# EAGLE design board_0.1v (EAGLE 7.7.0)
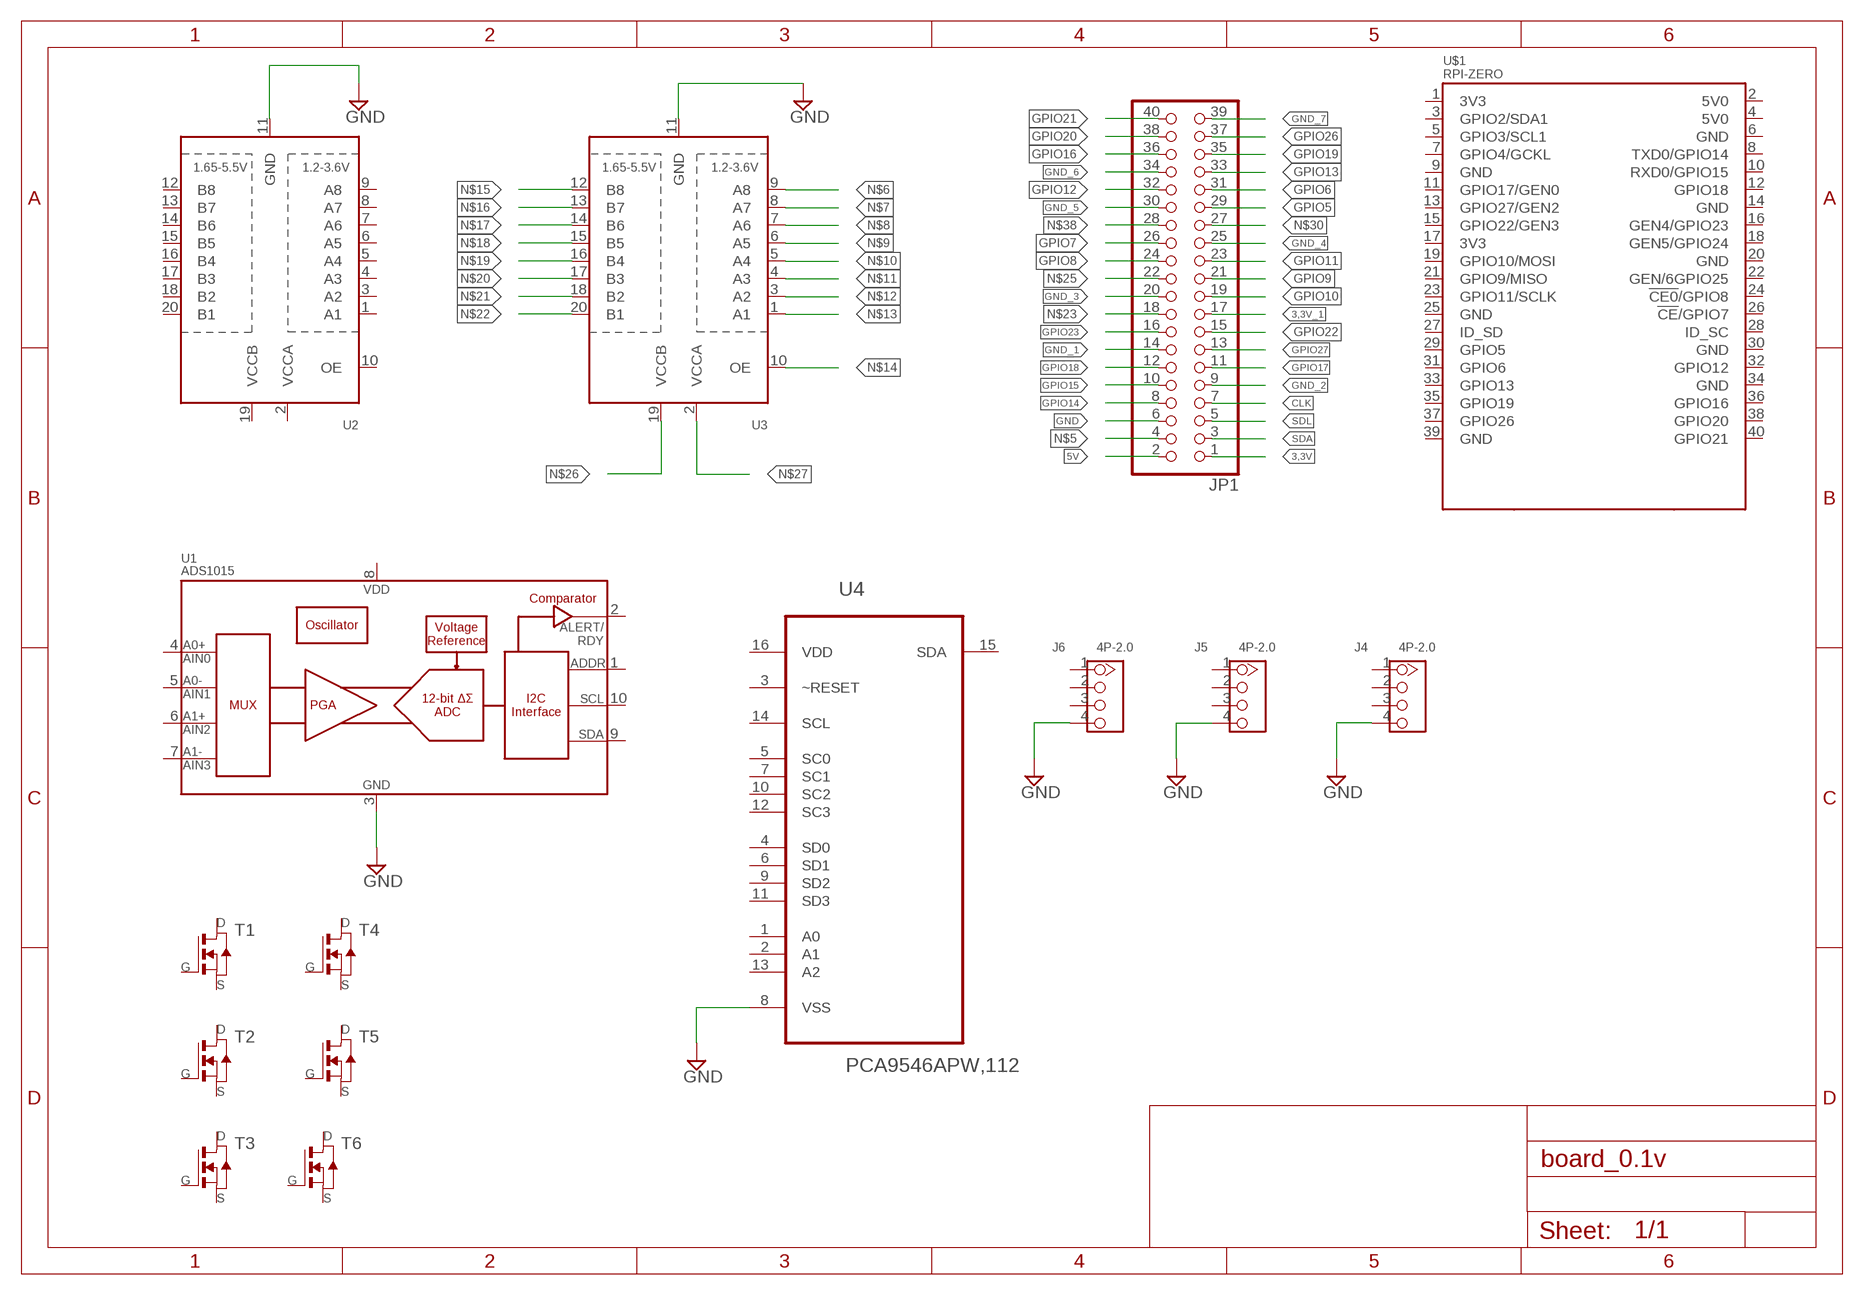
[diagram p0: schematic, sheet 1]

## Parts
J4  4P-2.0  GROVE-CONNECTOR-DIP(4P-2.0)  [HW4-2.0]
J5  4P-2.0  GROVE-CONNECTOR-DIP(4P-2.0)  [HW4-2.0]
J6  4P-2.0  GROVE-CONNECTOR-DIP(4P-2.0)  [HW4-2.0]
JP1  PINHD-2X20  [2X20]
T1  NMOSFETTO252  [TO252]
T2  NMOSFETTO252  [TO252]
T3  NMOSFETTO252  [TO252]
T4  NMOSFETTO252  [TO252]
T5  NMOSFETTO252  [TO252]
T6  NMOSFETTO252  [TO252]
U1  ADS1015  [MSOP10]
U2  TXB0108PWR  [TSSOP20]
U3  TXB0108PWR  [TSSOP20]
U4  PCA9546APW,112  [SOP65P640X110-16N]
U$1  RPI-ZERO  [RASPBERRYPI_BASTELSTUBE_V13_RASPI_BOARD_B+_FULL]

## Nets
3,3V: JP1.1
3,3V_1: JP1.17
5V: JP1.2
CLK: JP1.7
GND: J4.4 J5.4 J6.4 JP1.6 U1.3(VSS) U2.11(GND) U3.11(GND) U4.8(VSS)
GND_1: JP1.14
GND_2: JP1.9
GND_3: JP1.20
GND_4: JP1.25
GND_5: JP1.30
GND_6: JP1.34
GND_7: JP1.39
GPIO5: JP1.29
GPIO6: JP1.31
GPIO7: JP1.26
GPIO8: JP1.24
GPIO9: JP1.21
GPIO10: JP1.19
GPIO11: JP1.23
GPIO12: JP1.32
GPIO13: JP1.33
GPIO14: JP1.8
GPIO15: JP1.10
GPIO16: JP1.36
GPIO17: JP1.11
GPIO18: JP1.12
GPIO19: JP1.35
GPIO20: JP1.38
GPIO21: JP1.40
GPIO22: JP1.15
GPIO23: JP1.16
GPIO26: JP1.37
GPIO27: JP1.13
N$5: JP1.4
N$6: U3.9(A8)
N$7: U3.8(A7)
N$8: U3.7(A6)
N$9: U3.6(A5)
N$10: U3.5(A4)
N$11: U3.4(A3)
N$12: U3.3(A2)
N$13: U3.1(A1)
N$14: U3.10(OE)
N$15: U3.12(B8)
N$16: U3.13(B7)
N$17: U3.14(B6)
N$18: U3.15(B5)
N$19: U3.16(B4)
N$20: U3.17(B3)
N$21: U3.18(B2)
N$22: U3.20(B1)
N$23: JP1.18
N$25: JP1.22
N$26: U3.19(VCCB)
N$27: U3.2(VCCA)
N$30: JP1.27
N$38: JP1.28
SDA: JP1.3
SDL: JP1.5
Unconnected: J4.1 J4.2 J4.3 J5.1 J5.2 J5.3 J6.1 J6.2 J6.3 T1.1(G) T1.2(S) T1.3(D) T2.1(G) T2.2(S) T2.3(D) T3.1(G) T3.2(S) T3.3(D) T4.1(G) T4.2(S) T4.3(D) T5.1(G) T5.2(S) T5.3(D) T6.1(G) T6.2(S) T6.3(D) U1.1(ADDR) U1.2(ALERT/RDY) U1.4(AIN0) U1.5(AIN1) U1.6(AIN2) U1.7(AIN3) U1.8(VDD) U1.9(SDA) U1.10(SCL) U2.1(A1) U2.2(VCCA) U2.3(A2) U2.4(A3) U2.5(A4) U2.6(A5) U2.7(A6) U2.8(A7) U2.9(A8) U2.10(OE) U2.12(B8) U2.13(B7) U2.14(B6) U2.15(B5) U2.16(B4) U2.17(B3) U2.18(B2) U2.19(VCCB) U2.20(B1) U4.1(A0) U4.2(A1) U4.3(~RESET) U4.4(SD0) U4.5(SC0) U4.6(SD1) U4.7(SC1) U4.9(SD2) U4.10(SC2) U4.11(SD3) U4.12(SC3) U4.13(A2) U4.14(SCL) U4.15(SDA) U$1.1(3V3) U$1.2(5V0) U$1.3(GPIO2/SDA1) U$1.4(5V0) U$1.5(GPIO3/SCL1) U$1.6(GND) U$1.7(GPIO4/GCKL) U$1.8(TXD0/GPIO14) U$1.9(GND) U$1.10(RXD0/GPIO15) U$1.11(GPIO17/GEN0) U$1.12(GPIO18) U$1.13(GPIO27/GEN2) U$1.14(GND) U$1.15(GPIO22/GEN3) U$1.16(GEN4/GPIO23) U$1.17(3V3) U$1.18(GEN5/GPIO24) U$1.19(GPIO10/MOSI) U$1.20(GND) U$1.21(GPIO9/MISO) U$1.22(GEN/6GPIO25) U$1.23(GPIO11/SCLK) U$1.24(!CE0!/GPIO8) U$1.25(GND) U$1.26(!CE!/GPIO7) U$1.27(ID_SD) U$1.28(ID_SC) U$1.29(GPIO5) U$1.30(GND) U$1.31(GPIO6) U$1.32(GPIO12) U$1.33(GPIO13) U$1.34(GND) U$1.35(GPIO19) U$1.36(GPIO16) U$1.37(GPIO26) U$1.38(GPIO20) U$1.39(GND) U$1.40(GPIO21)

## Power pins joined to a net without a drawn wire
VDD: U4.16(VDD)

## Library data of the parts
J4-J6 = Seeed-OPL-Connector:GROVE-CONNECTOR-DIP(4P-2.0): 320110033
JP1 = adafruit:PINHD-2X20: PIN HEADER
T1-T6 = fab_2:NMOSFET: MOS FET
U1 = SparkFun-IC-Conversion:ADS1015: ADS1015 12-BIT ADC 12-Bit Del-Sig ADC Four single-ended inputs or two differential inputs Internal PGA I2C interface 2.0-5.5V SparkFun Products SparkFun Block for Intel Edison - ADC <https://www.sparkfun.com/products/13770> (DEV-13770); PROD_ID: IC-12270
U2 U3 = adafruit:TXB0108PWR: 8-Bit Bi-Directional Level Shifter 1.2V-3.6V (VCCA) to 1.65V-5.5V (VCCB) bi-directional level shifter with auto direction sensing. Max data rate - VCCA 1.8V: 20Mbps (50ns), VCCA 3.3V: 100Mbps (10ns) Digikey: 296-21527-1-ND
U4 = NXP_By_element14_Batch_1:PCA9546APW,112: 4-channel I2C-bus switch with reset; MPN: PCA9546APW,112; OC_FARNELL: 1831208; OC_NEWARK: 70R6610; PACKAGE: TSSOP-16; SUPPLIER: NXP
U$1 = RPI-Zero:RPI-ZERO

## Board
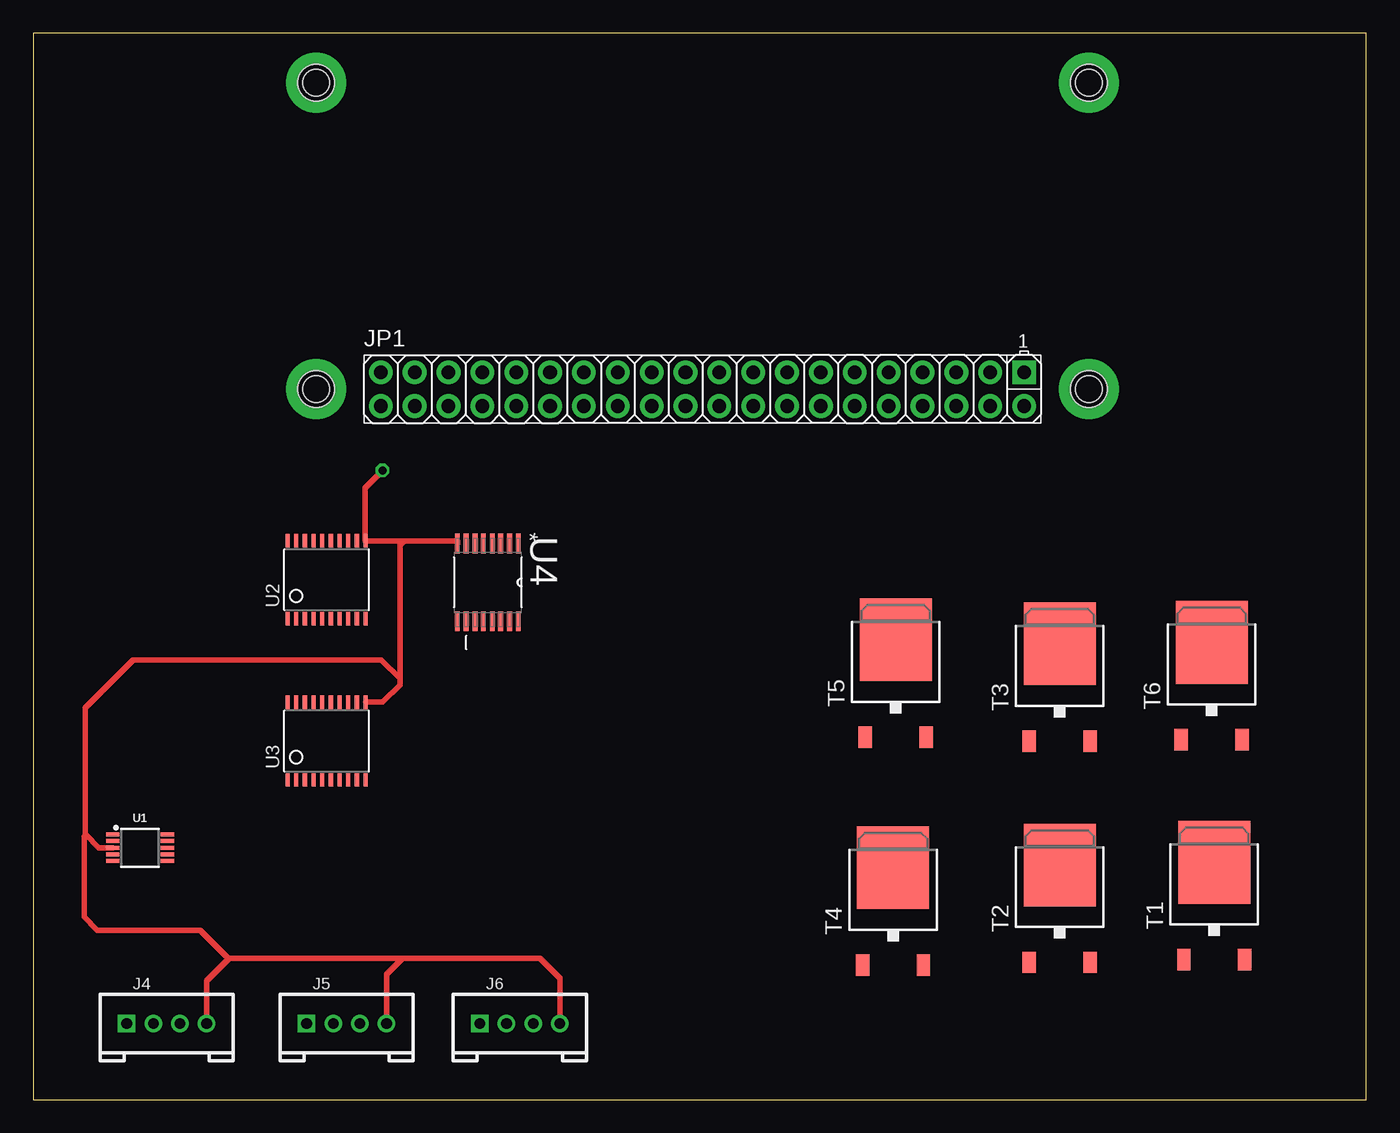
[diagram p1: board, top side]
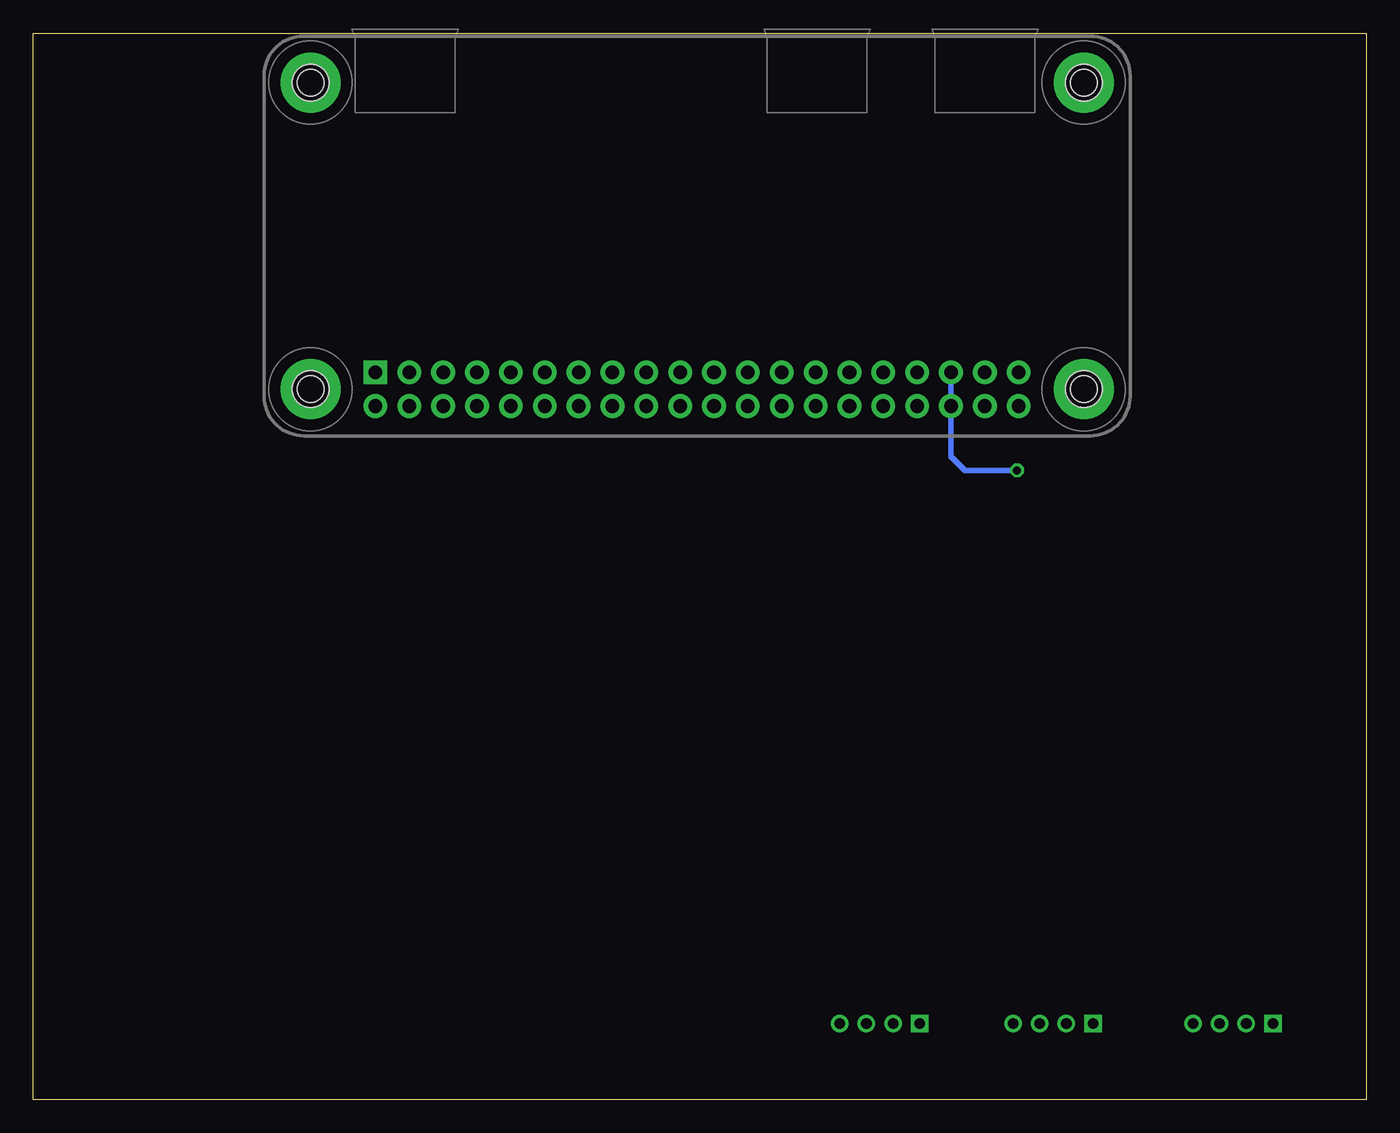
[diagram p2: board, bottom side, seen from below]

Size 100 x 80 mm. Coordinates in mm from the lower left corner, seen from the top.
Outline: 0,0 100,0 100,80 0,80 0,0
Copper layers (1*16): Top 0.035mm / dielectric 1.5mm / Bottom 0.035mm
Design rules "default": minimum track width 10mil, minimum drill 24mil, track to track 8mil, track to pad 8mil, pad to pad 8mil, via to via 8mil, smd to smd 8mil, copper to edge 40mil, drill to drill 8mil, minimum pad ring 10mil, minimum via ring 8mil, stop-mask expansion 4mil, vias tented up to drill 0mil, thermal gap 10mil
Holes 2 mm at 21.2,76.3 21.2,53.3 79.2,76.3 79.2,53.3

### Footprints (pad centres in the part's own frame; a part is rotated, then mirrored left to right if it is on the bottom)
HW4-2.0 = drill 0.8 pad 1.27 square: 1 -3,0 | drill 0.8 pad 1.27: 2 -1,0; 3 1,0; 4 3,0
2X20 = drill 1.016 octagon: 1 -24.13,-1.27; 2 -24.13,1.27; 3 -21.59,-1.27; 4 -21.59,1.27; 5 -19.05,-1.27; 6 -19.05,1.27; 7 -16.51,-1.27; 8 -16.51,1.27; 9 -13.97,-1.27; 10 -13.97,1.27; 11 -11.43,-1.27; 12 -11.43,1.27; 13 -8.89,-1.27; 14 -8.89,1.27; 15 -6.35,-1.27; 16 -6.35,1.27; 17 -3.81,-1.27; 18 -3.81,1.27; 19 -1.27,-1.27; 20 -1.27,1.27; 21 1.27,-1.27; 22 1.27,1.27; 23 3.81,-1.27; 24 3.81,1.27; 25 6.35,-1.27; 26 6.35,1.27; 27 8.89,-1.27; 28 8.89,1.27; 29 11.43,-1.27; 30 11.43,1.27; 31 13.97,-1.27; 32 13.97,1.27; 33 16.51,-1.27; 34 16.51,1.27; 35 19.05,-1.27; 36 19.05,1.27; 37 21.59,-1.27; 38 21.59,1.27; 39 24.13,-1.27; 40 24.13,1.27
TO252 = smd 1 x 1.6: 1 -2.28,-4.8; 2 2.28,-4.8 | smd 5.4 x 6.2: 3 0,2.5
MSOP10 = smd 0.3 x 1: 1 -1,-2.05; 2 -0.5,-2.05; 3 0,-2.05; 4 0.5,-2.05; 5 1,-2.05; 6 1,2.05; 7 0.5,2.05; 8 0,2.05; 9 -0.5,2.05; 10 -1,2.05
TSSOP20 = smd 0.305 x 0.991: 1 -2.925,-2.918; 2 -2.275,-2.918; 3 -1.625,-2.918; 4 -0.975,-2.918; 5 -0.325,-2.918; 6 0.325,-2.918; 7 0.975,-2.918; 8 1.625,-2.918; 9 2.275,-2.918; 10 2.925,-2.918; 11 2.925,2.918; 12 2.275,2.918; 13 1.625,2.918; 14 0.975,2.918; 15 0.325,2.918; 16 -0.325,2.918; 17 -0.975,2.918; 18 -1.625,2.918; 19 -2.275,2.918; 20 -2.925,2.918
SOP65P640X110-16N = smd 1.473 x 0.356: 1 -2.921,2.286; 2 -2.921,1.626; 3 -2.921,0.965; 4 -2.921,0.33; 5 -2.921,-0.33; 6 -2.921,-0.965; 7 -2.921,-1.626; 8 -2.921,-2.286; 9 2.921,-2.286; 10 2.921,-1.626; 11 2.921,-0.965; 12 2.921,-0.33; 13 2.921,0.33; 14 2.921,0.965; 15 2.921,1.626; 16 2.921,2.286
RASPBERRYPI_BASTELSTUBE_V13_RASPI_BOARD_B+_FULL = drill 1 pad 1.778 square: 1 8.37,25.23 | drill 1 pad 1.778: 2 8.37,27.77; 3 10.91,25.23; 4 10.91,27.77; 5 13.45,25.23; 6 13.45,27.77; 7 15.99,25.23; 8 15.99,27.77; 9 18.53,25.23; 10 18.53,27.77; 11 21.07,25.23; 12 21.07,27.77; 13 23.61,25.23; 14 23.61,27.77; 15 26.15,25.23; 16 26.15,27.77; 17 28.69,25.23; 18 28.69,27.77; 19 31.23,25.23; 20 31.23,27.77; 21 33.77,25.23; 22 33.77,27.77; 23 36.31,25.23; 24 36.31,27.77; 25 38.85,25.23; 26 38.85,27.77; 27 41.39,25.23; 28 41.39,27.77; 29 43.93,25.23; 30 43.93,27.77; 31 46.47,25.23; 32 46.47,27.77; 33 49.01,25.23; 34 49.01,27.77; 35 51.55,25.23; 36 51.55,27.77; 37 54.09,25.23; 38 54.09,27.77; 39 56.63,25.23; 40 56.63,27.77 | hole 2.75: 3.5,3.5; 3.5,26.5; 61.5,3.5; 61.5,26.5

### Placement (x,y rotation side)
J4  10,5.7 0 top
J5  23.5,5.7 0 top
J6  36.5,5.7 0 top
JP1  50.2,53.3 0 top
T1  88.6,15.3 0 top
T2  77,15.1 0 top
T3  77,31.7 0 top
T4  64.5,14.9 0 top
T5  64.7,32 0 top
T6  88.4,31.8 0 top
U1  8,18.9 270 top
U2  22,39 0 top
U3  22,26.9 0 top
U4  34.1,38.8 270 top
U$1  82.7,79.8 180 top

### Tracks (layer width: path | path; a pad name or v marks a point on that pad's centre or on a via)
GND  (via drill 0.6)
  Top 0.406: v26.2,47.2 24.9,45.9 24.9,41.94 U2.11 27.8,41.92 | 27.8,41.92 31.81,41.92 U4.8 | U3.11 26.22,29.82 27.5,31.1 27.5,31.6 | 27.5,31.6 27.5,41.62 27.8,41.92 | U1.3 4.9,18.9 3.95,19.85 | 3.95,19.85 3.9,19.9 3.9,29.4 7.5,33 26.1,33 27.5,31.6 | J4.4 13,8.9 14.7,10.6 | 14.7,10.6 27.7,10.6 | 27.7,10.6 38,10.6 39.5,9.1 J6.4 | J5.4 26.5,9.4 27.7,10.6 | 14.7,10.6 14.6,10.6 12.5,12.7 4.8,12.7 3.8,13.7 3.8,19.7 3.95,19.85
  Bottom 0.406: JP1.6 31.15,48.25 30.1,47.2 v26.2,47.2
N$1  (via drill 2.8 pad 4.5)
  other vias: 79.2,76.3
N$2  (via drill 2.8 pad 4.5)
  other vias: 21.2,76.3
N$3  (via drill 2.8 pad 4.5)
  other vias: 21.2,53.3
N$4  (via drill 2.8 pad 4.5)
  other vias: 79.2,53.3